# EAGLE design DEGREE_V3 (EAGLE 9.1.2)
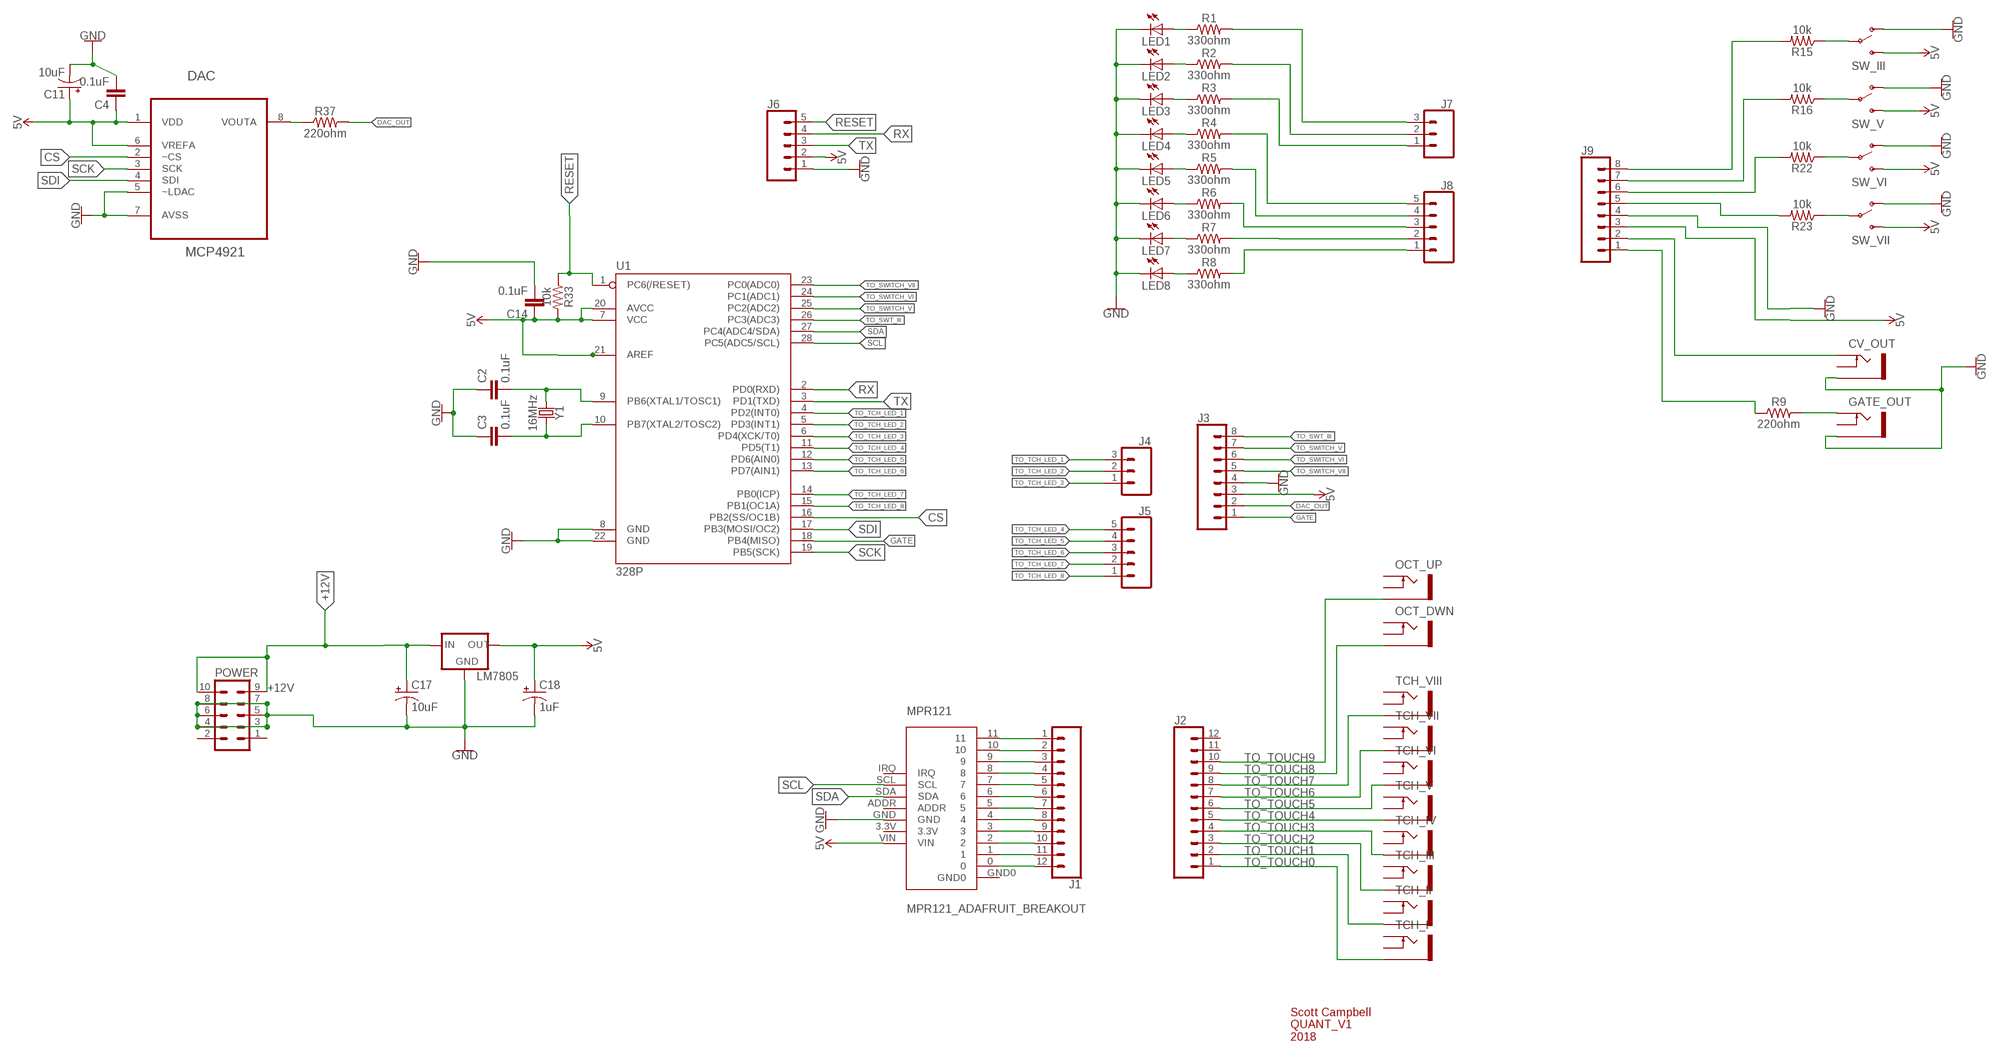
[diagram p0: schematic, sheet 1]

## Parts
C2  0.1uF  0.1UF-KIT-EZ-50V-20%  [CAP-PTH-SMALL-KIT]
C3  0.1uF  0.1UF-KIT-EZ-50V-20%  [CAP-PTH-SMALL-KIT]
C4  0.1uF  0.1UF-KIT-EZ-50V-20%  [CAP-PTH-SMALL-KIT]
C11  10uF  10UF-POLAR-RADIAL-2.5MM-25V-20%  [CPOL-RADIAL-2.5MM-5MM]
C14  0.1uF  0.1UF-KIT-EZ-50V-20%  [CAP-PTH-SMALL-KIT]
C17  10uF  10UF-POLAR-RADIAL-2.5MM-25V-20%  [CPOL-RADIAL-2.5MM-5MM]
C18  1uF  10UF-POLAR-RADIAL-2.5MM-25V-20%  [CPOL-RADIAL-2.5MM-5MM]
CV_OUT  CV_OUT  THONKICONNNEW  [WQP-PJ301M-12_JACK]
DAC  MCP4921  [DIP08]
GATE_OUT  GATE_OUT  THONKICONNNEW  [WQP-PJ301M-12_JACK]
J1  CONN_12  [1X12]
J2  CONN_12  [1X12]
J3  CONN_08"  [1X08]
J4  CONN_03  [1X03]
J5  CONN_05  [1X05]
J6  CONN_05  [1X05]
J7  CONN_03  [1X03]
J8  CONN_05  [1X05]
J9  CONN_08"  [1X08]
LED1  LED3MM  [LED3MM]
LED2  LED3MM  [LED3MM]
LED3  LED3MM  [LED3MM]
LED4  LED3MM  [LED3MM]
LED5  LED3MM  [LED3MM]
LED6  LED3MM  [LED3MM]
LED7  LED3MM  [LED3MM]
LED8  LED3MM  [LED3MM]
LM7805  V_REG_78XXTO-92_UNTESTED  [TO-92]
MPR121  MPR121_ADAFRUIT_BREAKOUT  [MPR121_ADAFRUIT_BREAKOUT]
OCT_DWN  THONKICONN-ESSY  [THONKICONN-ESSY]
OCT_UP  THONKICONN-ESSY  [THONKICONN-ESSY]
POWER  EURO_POWER_HEADERREGULAR  [EURO_POWER_HEADER]
R1  330ohm  1KOHM-HORIZ-1/4W-5%  [AXIAL-0.3]
R2  330ohm  1KOHM-HORIZ-1/4W-5%  [AXIAL-0.3]
R3  330ohm  1KOHM-HORIZ-1/4W-5%  [AXIAL-0.3]
R4  330ohm  1KOHM-HORIZ-1/4W-5%  [AXIAL-0.3]
R5  330ohm  1KOHM-HORIZ-1/4W-5%  [AXIAL-0.3]
R6  330ohm  1KOHM-HORIZ-1/4W-5%  [AXIAL-0.3]
R7  330ohm  1KOHM-HORIZ-1/4W-5%  [AXIAL-0.3]
R8  330ohm  1KOHM-HORIZ-1/4W-5%  [AXIAL-0.3]
R9  220ohm  RESISTOR_HORZ  [HORIZONTAL_RESISTOR]
R15  10k  RESISTOR_HORZ  [HORIZONTAL_RESISTOR]
R16  10k  RESISTOR_HORZ  [HORIZONTAL_RESISTOR]
R22  10k  RESISTOR_HORZ  [HORIZONTAL_RESISTOR]
R23  10k  RESISTOR_HORZ  [HORIZONTAL_RESISTOR]
R33  10k  RESISTOR_HORZ  [HORIZONTAL_RESISTOR]
R37  220ohm  RESISTOR_VERT  [VERTICAL_RESISTOR]
SW_III  SUBMINI_SPDT  [SUBMINI_TOGGLE]
SW_V  SUBMINI_SPDT  [SUBMINI_TOGGLE]
SW_VI  SUBMINI_SPDT  [SUBMINI_TOGGLE]
SW_VII  SUBMINI_SPDT  [SUBMINI_TOGGLE]
TCH_I  THONKICONN-ESSY  [THONKICONN-ESSY]
TCH_II  THONKICONN-ESSY  [THONKICONN-ESSY]
TCH_III  THONKICONN-ESSY  [THONKICONN-ESSY]
TCH_IV  THONKICONN-ESSY  [THONKICONN-ESSY]
TCH_V  THONKICONN-ESSY  [THONKICONN-ESSY]
TCH_VI  THONKICONN-ESSY  [THONKICONN-ESSY]
TCH_VII  THONKICONN-ESSY  [THONKICONN-ESSY]
TCH_VIII  THONKICONN-ESSY  [THONKICONN-ESSY]
U1  328P  ATMEGA328P_PDIP  [DIP28]
Y1  16MHz  CRYSTAL-16MHZPTH-HC49US  [HC49US]

## Nets
5V: C4.1 C11.1(+) C14.1 C18.1(+) DAC.1(VDD) DAC.6(VREFA) J3.3 J6.2 J9.3 LM7805.1(OUT) MPR121.VIN R33.2 SW_III.3(S) SW_V.3(S) SW_VI.3(S) SW_VII.3(S) U1.7(VCC) U1.20(AVCC) U1.21(AREF)
+12V: C17.1(+) LM7805.3(IN) POWER.9 POWER.10
CS: DAC.2(~CS) U1.16(PB2(SS/OC1B))
DAC_OUT: J3.2 R37.2
GATE: J3.1 U1.18(PB4(MISO))
GND: C2.1 C3.1 C4.2 C11.2(-) C14.2 C17.2(-) C18.2(-) CV_OUT.P$3_SLEEVE(SLEEVE) DAC.5(~LDAC) DAC.7(AVSS) GATE_OUT.P$3_SLEEVE(SLEEVE) J3.4 J6.1 J9.4 LED1.K(C) LED2.K(C) LED3.K(C) LED4.K(C) LED5.K(C) LED6.K(C) LED7.K(C) LED8.K(C) LM7805.2(GND) MPR121.GND POWER.3 POWER.4 POWER.5 POWER.6 POWER.7 POWER.8 SW_III.1(O) SW_V.1(O) SW_VI.1(O) SW_VII.1(O) U1.8(GND) U1.22(GND)
N$1: DAC.8(VOUTA) R37.1
N$2: GATE_OUT.P$1_TIP(TIP) R9.2
N$3: J9.5 R23.2
N$4: R23.1 SW_VII.COM(COMMON)
N$5: R22.1 SW_VI.COM(COMMON)
N$6: R16.1 SW_V.COM(COMMON)
N$7: R15.1 SW_III.COM(COMMON)
N$8: J9.6 R22.2
N$9: C3.2 U1.10(PB7(XTAL2/TOSC2)) Y1.2
N$10: J9.7 R16.2
N$11: C2.2 U1.9(PB6(XTAL1/TOSC1)) Y1.1
N$12: J9.8 R15.2
N$14: J9.1 R9.1
N$15: CV_OUT.P$1_TIP(TIP) J9.2
N$21: J1.1 MPR121.11
N$25: J1.2 MPR121.10
N$31: J1.3 MPR121.9
N$34: J1.4 MPR121.8
N$37: J1.5 MPR121.7
N$38: J1.6 MPR121.6
N$39: J1.7 MPR121.5
N$42: LED1.A R1.P$1
N$43: LED2.A R2.P$1
N$44: J1.8 MPR121.4
N$45: J1.9 MPR121.3
N$46: J1.10 MPR121.2
N$47: J1.11 MPR121.1
N$48: J1.12 MPR121.0
N$50: LED3.A R3.P$1
N$51: LED4.A R4.P$1
N$52: LED5.A R5.P$1
N$53: LED6.A R6.P$1
N$54: LED7.A R7.P$1
N$55: LED8.A R8.P$1
RESET: J6.5 R33.1 U1.1(PC6(/RESET))
RX: J6.4 U1.2(PD0(RXD))
SCK: DAC.3(SCK) U1.19(PB5(SCK))
SCL: MPR121.SCL U1.28(PC5(ADC5/SCL))
SDA: MPR121.SDA U1.27(PC4(ADC4/SDA))
SDI: DAC.4(SDI) U1.17(PB3(MOSI/OC2))
TCH_LED_1: J7.3 R1.P$2
TCH_LED_2: J7.2 R2.P$2
TCH_LED_3: J7.1 R3.P$2
TCH_LED_4: J8.5 R4.P$2
TCH_LED_5: J8.4 R5.P$2
TCH_LED_6: J8.3 R6.P$2
TCH_LED_7: J8.2 R7.P$2
TCH_LED_8: J8.1 R8.P$2
TO_SWITCH_V: J3.7 U1.25(PC2(ADC2))
TO_SWITCH_VI: J3.6 U1.24(PC1(ADC1))
TO_SWITCH_VII: J3.5 U1.23(PC0(ADC0))
TO_SWT_III: J3.8 U1.26(PC3(ADC3))
TO_TCH_LED_1: J4.3 U1.4(PD2(INT0))
TO_TCH_LED_2: J4.2 U1.5(PD3(INT1))
TO_TCH_LED_3: J4.1 U1.6(PD4(XCK/T0))
TO_TCH_LED_4: J5.5 U1.11(PD5(T1))
TO_TCH_LED_5: J5.4 U1.12(PD6(AIN0))
TO_TCH_LED_6: J5.3 U1.13(PD7(AIN1))
TO_TCH_LED_7: J5.2 U1.14(PB0(ICP))
TO_TCH_LED_8: J5.1 U1.15(PB1(OC1A))
TO_TOUCH0: J2.1 TCH_I.P$3_SLEEVE(SLEEVE)
TO_TOUCH1: J2.2 TCH_II.P$3_SLEEVE(SLEEVE)
TO_TOUCH2: J2.3 TCH_III.P$3_SLEEVE(SLEEVE)
TO_TOUCH3: J2.4 TCH_IV.P$3_SLEEVE(SLEEVE)
TO_TOUCH4: J2.5 TCH_V.P$3_SLEEVE(SLEEVE)
TO_TOUCH5: J2.6 TCH_VI.P$3_SLEEVE(SLEEVE)
TO_TOUCH6: J2.7 TCH_VII.P$3_SLEEVE(SLEEVE)
TO_TOUCH7: J2.8 TCH_VIII.P$3_SLEEVE(SLEEVE)
TO_TOUCH8: J2.9 OCT_DWN.P$3_SLEEVE(SLEEVE)
TO_TOUCH9: J2.10 OCT_UP.P$3_SLEEVE(SLEEVE)
TX: J6.3 U1.3(PD1(TXD))
Unconnected: CV_OUT.P$2_SWITCH(SWITCH) GATE_OUT.P$2_SWITCH(SWITCH) J2.11 J2.12 MPR121.3.3V MPR121.ADDR MPR121.GND0 MPR121.IRQ OCT_DWN.P$1_TIP(TIP) OCT_DWN.P$2_SWITCH(SWITCH) OCT_UP.P$1_TIP(TIP) OCT_UP.P$2_SWITCH(SWITCH) POWER.1 POWER.2 TCH_I.P$1_TIP(TIP) TCH_I.P$2_SWITCH(SWITCH) TCH_II.P$1_TIP(TIP) TCH_II.P$2_SWITCH(SWITCH) TCH_III.P$1_TIP(TIP) TCH_III.P$2_SWITCH(SWITCH) TCH_IV.P$1_TIP(TIP) TCH_IV.P$2_SWITCH(SWITCH) TCH_V.P$1_TIP(TIP) TCH_V.P$2_SWITCH(SWITCH) TCH_VI.P$1_TIP(TIP) TCH_VI.P$2_SWITCH(SWITCH) TCH_VII.P$1_TIP(TIP) TCH_VII.P$2_SWITCH(SWITCH) TCH_VIII.P$1_TIP(TIP) TCH_VIII.P$2_SWITCH(SWITCH)

## Notes on the sheet
- Scott Campbell
  QUANT_V1
  2018

## Library data of the parts
C2-C4 C14 = SparkFun-Capacitors:0.1UF: 0.1µF ceramic capacitors A capacitor is a passive two-terminal electrical component used to store electrical energy temporarily in an electric field.; PROD_ID: CAP-08370
C11 C17 = SparkFun-Capacitors:10UF-POLAR: 10.0µF polarized capacitors A capacitor is a passive two-terminal electrical component used to store electrical energy temporarily in an electric field.; PROD_ID: CAP-08440
C18 = SparkFun-Capacitors:10UF-POLAR: 10.0µF polarized capacitors A capacitor is a passive two-terminal electrical component used to store electrical energy temporarily in an electric field.; PROD_ID: CAP-08440; VALUE: 10uF
CV_OUT GATE_OUT = MusicThingModular:THONKICONN: 3.5mm socket for Eurorack modular synths
DAC = ESSY:MCP4921
J1 J2 = SparkFun-Connectors:CONN_12: Multi connection point. Often used as Generic Header-pin footprint for 0.1 inch spaced/style header connections On any of the 0.1 inch spaced packages, you can populate with these: Break Away Headers - Straight <https://www.sparkfun.com/products/116> (PRT-00116) Break Away Male Headers - Right Angle <https://www.sparkfun.com/products/553> (PRT-00553) Female Headers <https://www.sparkfun.com/products/115> (PRT-00115) Break Away Headers - Machine Pin <https://www.sparkfun.com/products/117> (PRT-00117) Break Away Female Headers - Swiss Machine Pin <https://www.sparkfun.com/products/743> (PRT-00743) For SCREWTERMINALS and SPRING TERMINALS visit here: Screw Terimnals on SparkFun.com <https://www.sparkfun.com/search/results?term=Screw+Terminals> (5mm/3.5mm/2.54mm spacing) This device is also useful as a general connection point to wire up your design to another part of your project. Our various solder wires solder well into these plated through hole pads. Hook-Up Wire - Assortment (Stranded, 22 AWG) <https://www.sparkfun.com/products/11375> (PRT-11375) Hook-Up Wire - Assortment (Solid Core, 22 AWG) <https://www.sparkfun.com/products/11367> (PRT-11367) View the entire wire category on our website here <https://www.sparkfun.com/categories/141> Special notes: Molex polarized connector foot print use with SKU : PRT-08231 with associated crimp pins and housings. 1MM SMD Version SKU: PRT-10208 NOTES ON THE VARIANTS LOCK and LOCK_LONGPADS... This footprint was designed to help hold the alignment of a through-hole component (i.e. 6-pin header) while soldering it into place. You may notice that each hole has been shifted either up or down by 0.005 of an inch from it's more standard position (which is a perfectly straight line). This slight alteration caused the pins (the squares in the middle) to touch the edges of the holes. Because they are alternating, it causes a "brace" to hold the component in place. 0.005 has proven to be the perfect amount of "off-center" position when using our standard breakaway headers. Although looks a little odd when you look at the bare footprint, once you have a header in there, the alteration is very hard to notice. Also,if you push a header all the way into place, it is covered up entirely on the bottom side.
J3 J9 = SparkFun-Connectors:CONN_08: Multi connection point. Often used as Generic Header-pin footprint for 0.1 inch spaced/style header connections On any of the 0.1 inch spaced packages, you can populate with these: Break Away Headers - Straight <https://www.sparkfun.com/products/116> (PRT-00116) Break Away Male Headers - Right Angle <https://www.sparkfun.com/products/553> (PRT-00553) Female Headers <https://www.sparkfun.com/products/115> (PRT-00115) Break Away Headers - Machine Pin <https://www.sparkfun.com/products/117> (PRT-00117) Break Away Female Headers - Swiss Machine Pin <https://www.sparkfun.com/products/743> (PRT-00743) Arduino Stackable Header - 8 Pin <https://www.sparkfun.com/products/9279> (PRT-09279) For SCREWTERMINALS and SPRING TERMINALS visit here: Screw Terimnals on SparkFun.com <https://www.sparkfun.com/search/results?term=Screw+Terminals> (5mm/3.5mm/2.54mm spacing) This device is also useful as a general connection point to wire up your design to another part of your project. Our various solder wires solder well into these plated through hole pads. Hook-Up Wire - Assortment (Stranded, 22 AWG) <https://www.sparkfun.com/products/11375> (PRT-11375) Hook-Up Wire - Assortment (Solid Core, 22 AWG) <https://www.sparkfun.com/products/11367> (PRT-11367) View the entire wire category on our website here <https://www.sparkfun.com/categories/141> Special notes: Molex polarized connector foot print use with SKU : PRT-08231 with associated crimp pins and housings. 1MM SMD Version SKU: PRT-10208 NOTES ON THE VARIANTS LOCK and LOCK_LONGPADS... This footprint was designed to help hold the alignment of a through-hole component (i.e. 6-pin header) while soldering it into place. You may notice that each hole has been shifted either up or down by 0.005 of an inch from it's more standard position (which is a perfectly straight line). This slight alteration caused the pins (the squares in the middle) to touch the edges of the holes. Because they are alternating, it causes a "brace" to hold the component in place. 0.005 has proven to be the perfect amount of "off-center" position when using our standard breakaway headers. Although looks a little odd when you look at the bare footprint, once you have a header in there, the alteration is very hard to notice. Also,if you push a header all the way into place, it is covered up entirely on the bottom side.; PROD_ID: CONN-08438
J4 J7 = SparkFun-Connectors:CONN_03: Multi connection point. Often used as Generic Header-pin footprint for 0.1 inch spaced/style header connections On any of the 0.1 inch spaced packages, you can populate with these: Break Away Headers - Straight <https://www.sparkfun.com/products/116> (PRT-00116) Break Away Male Headers - Right Angle <https://www.sparkfun.com/products/553> (PRT-00553) Female Headers <https://www.sparkfun.com/products/115> (PRT-00115) Break Away Headers - Machine Pin <https://www.sparkfun.com/products/117> (PRT-00117) Break Away Female Headers - Swiss Machine Pin <https://www.sparkfun.com/products/743> (PRT-00743) Stackable Header - 3 Pin (Female, 0.1") <https://www.sparkfun.com/products/13875> (PRT-13875) For SCREWTERMINALS and SPRING TERMINALS visit here: Screw Terimnals on SparkFun.com <https://www.sparkfun.com/search/results?term=Screw+Terminals> (5mm/3.5mm/2.54mm spacing) This device is also useful as a general connection point to wire up your design to another part of your project. Our various solder wires solder well into these plated through hole pads. Hook-Up Wire - Assortment (Stranded, 22 AWG) <https://www.sparkfun.com/products/11375> (PRT-11375) Hook-Up Wire - Assortment (Solid Core, 22 AWG) <https://www.sparkfun.com/products/11367> (PRT-11367) View the entire wire category on our website here <https://www.sparkfun.com/categories/141> Special notes: Molex polarized connector foot print use with SKU : PRT-08232 with associated crimp pins and housings.; PROD_ID: XXX-00000; VALUE: 455-1750-1-ND
J5 J6 J8 = SparkFun-Connectors:CONN_05: Multi connection point. Often used as Generic Header-pin footprint for 0.1 inch spaced/style header connections On any of the 0.1 inch spaced packages, you can populate with these: Break Away Headers - Straight <https://www.sparkfun.com/products/116> (PRT-00116) Break Away Male Headers - Right Angle <https://www.sparkfun.com/products/553> (PRT-00553) Female Headers <https://www.sparkfun.com/products/115> (PRT-00115) Break Away Headers - Machine Pin <https://www.sparkfun.com/products/117> (PRT-00117) Break Away Female Headers - Swiss Machine Pin <https://www.sparkfun.com/products/743> (PRT-00743) For SCREWTERMINALS and SPRING TERMINALS visit here: Screw Terimnals on SparkFun.com <https://www.sparkfun.com/search/results?term=Screw+Terminals> (5mm/3.5mm/2.54mm spacing) This device is also useful as a general connection point to wire up your design to another part of your project. Our various solder wires solder well into these plated through hole pads. Hook-Up Wire - Assortment (Stranded, 22 AWG) <https://www.sparkfun.com/products/11375> (PRT-11375) Hook-Up Wire - Assortment (Solid Core, 22 AWG) <https://www.sparkfun.com/products/11367> (PRT-11367) View the entire wire category on our website here <https://www.sparkfun.com/categories/141> Special notes: Molex polarized connector foot print use with SKU : PRT-08231 with associated crimp pins and housings. 1MM SMD Version SKU: PRT-10208
LED1-LED8 = adafruit:LED: LED OSRAM: - CHIPLED LG R971, LG N971, LY N971, LG Q971, LY Q971, LO R971, LY R971 LH N974, LH R974 LS Q976, LO Q976, LY Q976 LO Q996 - Hyper CHIPLED LW Q18S LB Q993, LB Q99A, LB R99A - SideLED LS A670, LO A670, LY A670, LG A670, LP A670 LB A673, LV A673, LT A673, LW A673 LH A674 LY A675 LS A676, LA A676, LO A676, LY A676, LW A676 LS A679, LY A679, LG A679 - Hyper Micro SIDELED® LS Y876, LA Y876, LO Y876, LY Y876 LT Y87S - SmartLED LW L88C, LW L88S LB L89C, LB L89S, LG L890 LS L89K, LO L89K, LY L89K LS L896, LA L896, LO L896, LY L896 - TOPLED LS T670, LO T670, LY T670, LG T670, LP T670 LSG T670, LSP T670, LSY T670, LOP T670, LYG T670 LG T671, LOG T671, LSG T671 LB T673, LV T673, LT T673, LW T673 LH T674 LS T676, LA T676, LO T676, LY T676, LB T676, LH T676, LSB T676, LW T676 LB T67C, LV T67C, LT T67C, LS T67K, LO T67K, LY T67K, LW E67C LS E67B, LA E67B, LO E67B, LY E67B, LB E67C, LV E67C, LT E67C LW T67C LS T679, LY T679, LG T679 LS T770, LO T770, LY T770, LG T770, LP T770 LB T773, LV T773, LT T773, LW T773 LH T774 LS E675, LA E675, LY E675, LS T675 LS T776, LA T776, LO T776, LY T776, LB T776 LHGB T686 LT T68C, LB T68C - Hyper Mini TOPLED® LB M676 - Mini TOPLED Santana® LG M470 LS M47K, LO M47K, LY M47K Source: http://www.osram.convergy.de/
LM7805 = SparkFun-IC-Power:V_REG_78XX: Voltage Regulator Standard 78xx regulator. IGO (Input Ground Output). Spark Fun Electronics SKU : COM-00107
MPR121 = ESSY:MPR121_ADAFRUIT_BREAKOUT
OCT_DWN OCT_UP TCH_I TCH_II TCH_III TCH_IV TCH_V TCH_VI TCH_VII TCH_VIII = ESSY:THONKICONN-ESSY
POWER = MusicThingModular:EURO_POWER_HEADER: Power Header 10 pin power header for Eurorack Power Supplies Variants with fatter pads for easier soldering, and the LOCK variant which has 5mil offset pins to hold the component in place before soldering
R1-R8 = SparkFun-Resistors:1KOHM: 1kΩ resistor A resistor is a passive two-terminal electrical component that implements electrical resistance as a circuit element. Resistors act to reduce current flow, and, at the same time, act to lower voltage levels within circuits. - Wikipedia; PROD_ID: RES-08380; VALUE: 1k
R9 R15 R16 R22 R23 R33 = ESSY:RESISTOR_HORZ
R37 = ESSY:RESISTOR_VERT
SW_III SW_V SW_VI SW_VII = MusicThingModular:SUBMINI_SPDT
U1 = SparkFun-IC-Microcontroller:ATMEGA328P_PDIP: Atmel 328P Through hole ATMEGA328P uC used in the Arduino 32kb flash, 1k EEPROM, 2k SRAM Datasheet <http://www.sparkfun.com/datasheets/Components/SMD/ATMega328.pdf> SparkFun Products Storefront component: AVR 28 Pin 20MHz 32K 6A/D - ATMega328P <https://www.sparkfun.com/products/9061> (COM-09061) SparkFun Simon Says - Through-Hole Soldering Kit <https://www.sparkfun.com/products/10547> (KIT-10547) SparkFun Learn to Solder - Simon Says <https://www.sparkfun.com/products/13708> (KIT-13708) SparkFun BigTime Watch Kit <https://www.sparkfun.com/products/11734> (KIT-11734) SparkFun ClockIt <https://www.sparkfun.com/products/10930> (KIT-10930) SparkFun Serial Enabled LCD Kit <https://www.sparkfun.com/products/10097> (LCD-10097) SparkFun Simon Tilts - Through Hole Soldering Kit <https://www.sparkfun.com/products/12634> (KIT-12634) SparkFun Frequency Counter Kit <https://www.sparkfun.com/products/10140> (KIT-10140) FabFM Radio Kit <https://www.sparkfun.com/products/11043> (KIT-11043) SparkFun Binary Blaster Kit <https://www.sparkfun.com/products/12037> (KIT-12037) SparkFun Metro-Gnome <https://www.sparkfun.com/products/9236> (KIT-09236) ATmega328 with Arduino Optiboot (Uno) <https://www.sparkfun.com/products/10524> (DEV-10524); PROD_ID: IC-09136
Y1 = SparkFun-Clocks:CRYSTAL-16MHZ: 16MHz Crystal Digikey Example <http://www.digikey.com/product-search/en?keywords=535-9122-1-ND> Frequency: 16MHz Frequency Stability: ±50ppm Frequency Tolerance: ±20ppm Load Capacitance: 18pF SparkFun Products: Pro Micro -5V/16MHz <https://www.sparkfun.com/products/12640> SparkFun Serial Enabled LCD Kit <https://www.sparkfun.com/products/10097>; PROD_ID: XTAL-08181; SF_ID: COM-00536

## Board
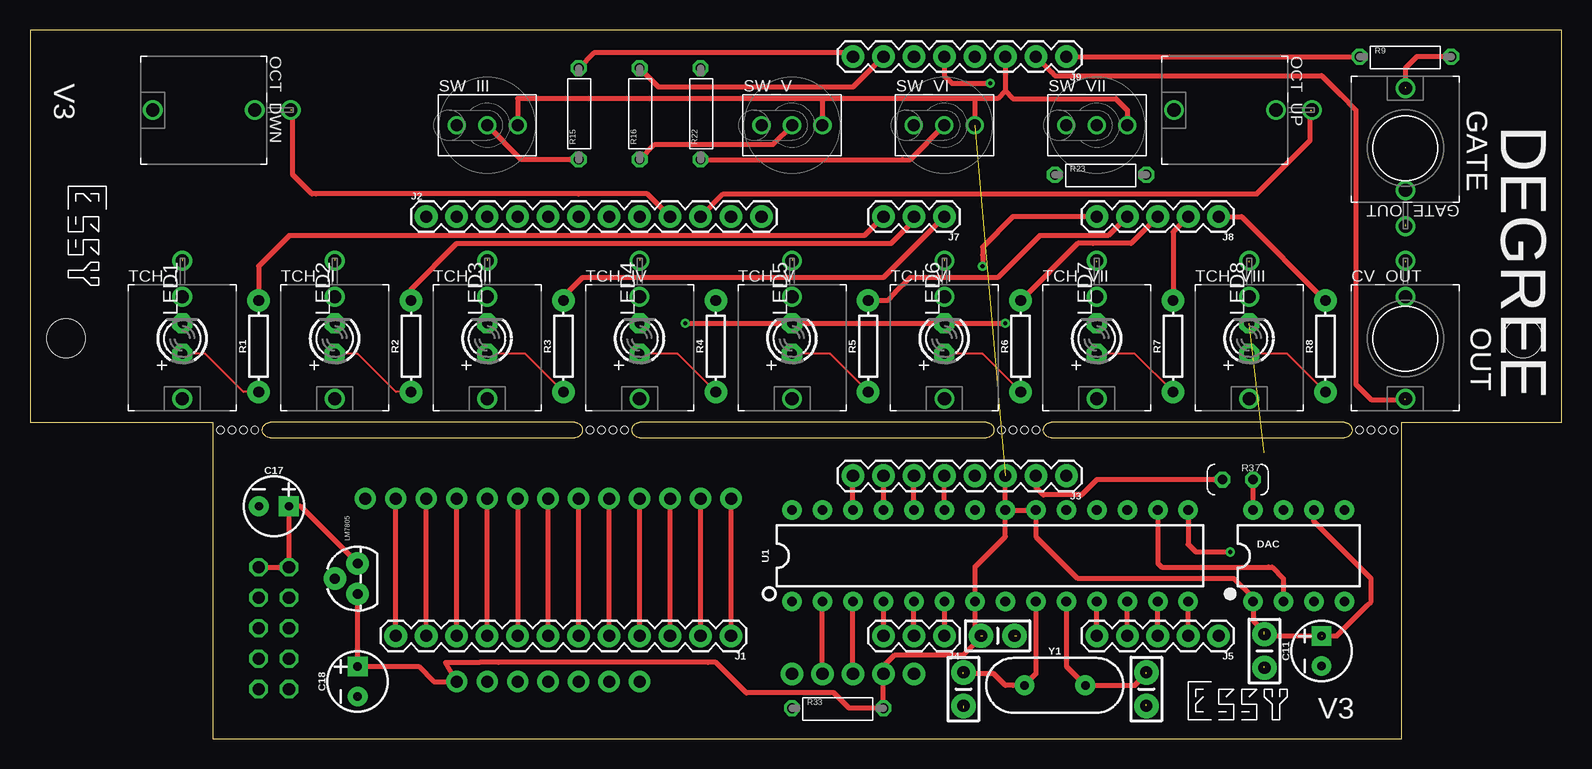
[diagram p1: board, top side]
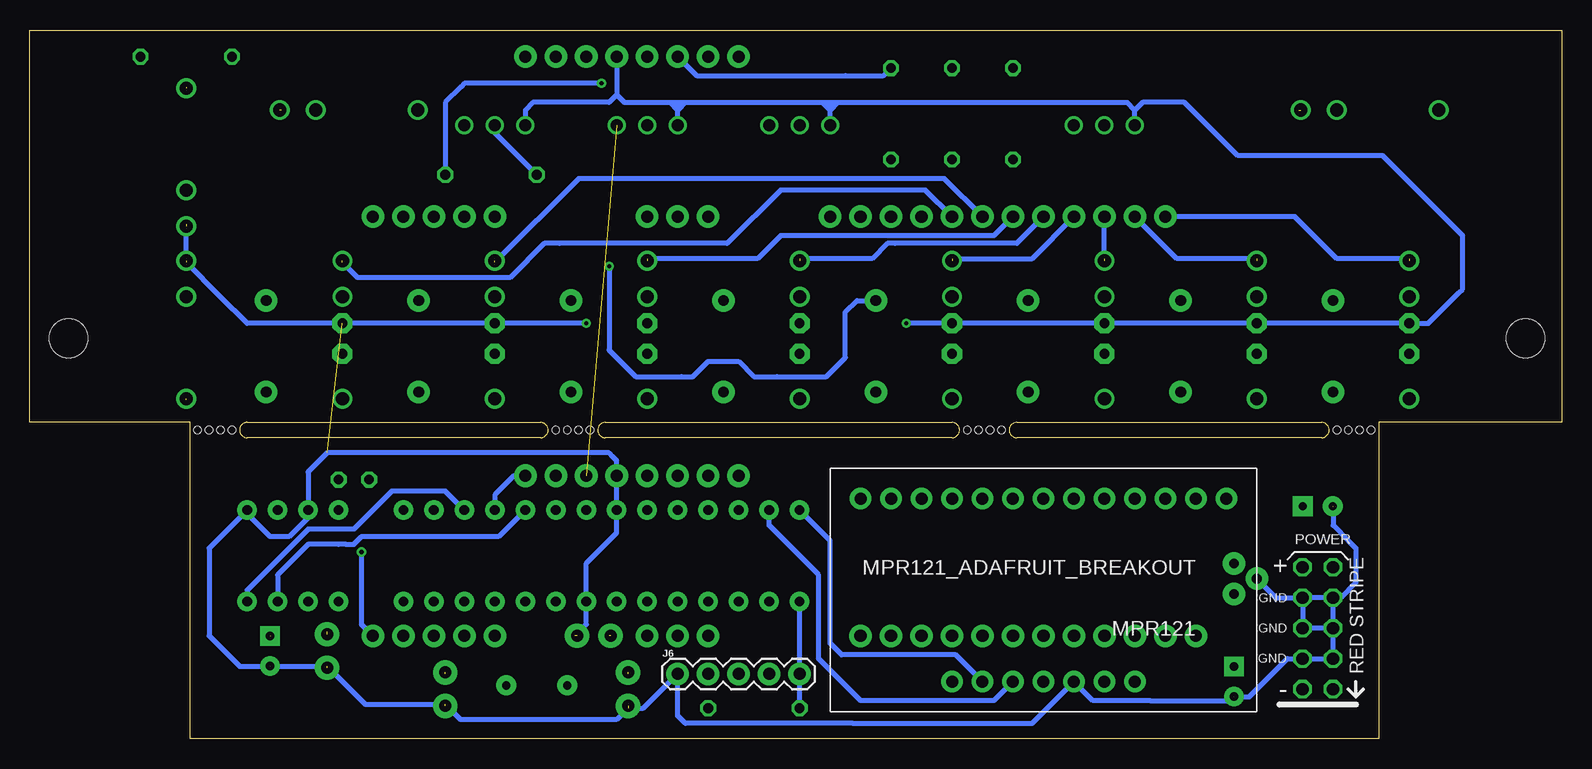
[diagram p2: board, bottom side, seen from below]

Size 127.64 x 59.05 mm. Coordinates in mm from the lower left corner, seen from the top.
Outline: 15.24,0 114.3,0 114.3,26.35 127.64,26.35 127.64,59.05 0,59.05 0,26.35 15.24,26.35 15.24,0
Outline: 20,25.08 45.4,25.08 arc180 45.4,26.35 20,26.35 arc180 20,25.08
Outline: 85.09,25.08 109.54,25.08 arc180 109.54,26.35 85.09,26.35 arc180 85.09,25.08
Outline: 50.8,25.08 79.69,25.08 arc180 79.69,26.35 50.8,26.35 arc180 50.8,25.08
Copper layers (1*16): Top 0.035mm / dielectric 1.5mm / Bottom 0.035mm
Design rules "default": minimum track width 6mil, minimum drill 0.35mm, track to track 6mil, track to pad 6mil, pad to pad 6mil, via to via 6mil, smd to smd 6mil, copper to edge 40mil, drill to drill 6mil, minimum pad ring 10mil, minimum via ring 8mil, stop-mask expansion 4mil, vias tented up to drill 0mil, thermal gap 10mil
Holes 0.6 mm at 110.81,25.72 111.76,25.72 112.71,25.72 113.67,25.72 80.96,25.72 81.92,25.72 82.87,25.72 83.82,25.72 15.88,25.72 16.83,25.72 17.78,25.72 18.73,25.72 46.67,25.72 47.62,25.72 48.58,25.72 49.53,25.72

### Footprints (pad centres in the part's own frame; a part is rotated, then mirrored left to right if it is on the bottom)
CAP-PTH-SMALL-KIT = drill 1.016 pad 2.032: 1 -1.397,0; 2 1.397,0
CPOL-RADIAL-2.5MM-5MM = drill 0.7 pad 1.651 square: 1 1.25,0 | drill 0.7 pad 1.651: 2 -1.25,0
WQP-PJ301M-12_JACK = drill 1.1: P$1_TIP 0,5; P$2_SWITCH 0,-3.5; P$3_SLEEVE 0,-6.5
DIP08 = drill 0.813 pad 1.626: 1 -3.81,-3.81; 2 -1.27,-3.81; 3 1.27,-3.81; 4 3.81,-3.81; 5 3.81,3.81; 6 1.27,3.81; 7 -1.27,3.81; 8 -3.81,3.81
1X12 = drill 1.016 pad 1.88: 1 0,0; 2 2.54,0; 3 5.08,0; 4 7.62,0; 5 10.16,0; 6 12.7,0; 7 15.24,0; 8 17.78,0; 9 20.32,0; 10 22.86,0; 11 25.4,0; 12 27.94,0
1X08 = drill 1.016 pad 1.88: 1 0,0; 2 2.54,0; 3 5.08,0; 4 7.62,0; 5 10.16,0; 6 12.7,0; 7 15.24,0; 8 17.78,0
1X03 = drill 1.016 pad 1.88: 1 0,0; 2 2.54,0; 3 5.08,0
1X05 = drill 1.016 pad 1.88: 1 0,0; 2 2.54,0; 3 5.08,0; 4 7.62,0; 5 10.16,0
LED3MM = drill 0.813 pad 1.676 octagon: A -1.27,0; K 1.27,0
TO-92 = drill 0.813 pad 1.88: 1 -1.27,0; 2 0,1.905; 3 1.27,0
MPR121_ADAFRUIT_BREAKOUT = drill 1 pad 1.778: 0 17.78,-30.48; 1 17.78,-27.94; 2 17.78,-25.4; 3 17.78,-22.86; 3.3V 2.54,-22.86; 4 17.78,-20.32; 5 17.78,-17.78; 6 17.78,-15.24; 7 17.78,-12.7; 8 17.78,-10.16; 9 17.78,-7.62; 10 17.78,-5.08; 11 17.78,-2.54; ADDR 2.54,-17.78; GND 2.54,-20.32; GND0 17.78,-33.02; IRQ 2.54,-10.16; SCL 2.54,-12.7; SDA 2.54,-15.24; VIN 2.54,-25.4
THONKICONN-ESSY = drill 1.1: P$1_TIP 0,5; P$2_SWITCH 0,-3.5; P$3_SLEEVE 0,-6.5
EURO_POWER_HEADER = drill 1.016 octagon: 1 -5.08,-1.27; 2 -5.08,1.27; 3 -2.54,-1.27; 4 -2.54,1.27; 5 0,-1.27; 6 0,1.27; 7 2.54,-1.27; 8 2.54,1.27; 9 5.08,-1.27; 10 5.08,1.27
AXIAL-0.3 = drill 0.9 pad 1.88: P$1 -3.81,0; P$2 3.81,0
HORIZONTAL_RESISTOR = drill 0.813 octagon: 1 -3.81,0; 2 3.81,0
VERTICAL_RESISTOR = drill 0.813 octagon: 1 -1.27,0; 2 1.27,0
SUBMINI_TOGGLE = drill 1 pad 1.422: 1 -2.54,0; 3 2.54,0; COM 0,0
DIP28 = drill 0.813 pad 1.626: 1 -16.51,-3.81; 2 -13.97,-3.81; 3 -11.43,-3.81; 4 -8.89,-3.81; 5 -6.35,-3.81; 6 -3.81,-3.81; 7 -1.27,-3.81; 8 1.27,-3.81; 9 3.81,-3.81; 10 6.35,-3.81; 11 8.89,-3.81; 12 11.43,-3.81; 13 13.97,-3.81; 14 16.51,-3.81; 15 16.51,3.81; 16 13.97,3.81; 17 11.43,3.81; 18 8.89,3.81; 19 6.35,3.81; 20 3.81,3.81; 21 1.27,3.81; 22 -1.27,3.81; 23 -3.81,3.81; 24 -6.35,3.81; 25 -8.89,3.81; 26 -11.43,3.81; 27 -13.97,3.81; 28 -16.51,3.81
EURO_PANEL_SCREW_HOLE = hole 3.2: -0.032,0.032
HC49US = drill 0.7 pad 1.651: 1 -2.54,0; 2 2.54,0

### Placement (x,y rotation side)
C2  77.79,4.13 90 top
C3  93.03,4.13 90 top
C4  102.87,7.3 270 top
C11  107.63,7.3 90 top
C14  80.64,8.57 0 top
C17  20.32,19.37 0 top
C18  27.3,4.76 90 top
CV_OUT  114.62,33.34 180 top
DAC  105.73,15.24 0 top
GATE_OUT  114.62,49.21 0 top
J1  58.42,8.57 180 top
J2  33.02,43.5 0 top
J3  86.36,21.91 180 top
J4  76.2,8.57 180 top
J5  99.06,8.57 180 top
J6  73.66,5.4 0 bottom
J7  76.2,43.5 180 top
J8  99.06,43.5 180 top
J9  86.36,56.83 180 top
LED1  12.7,33.34 90 top
LED2  25.4,33.34 90 top
LED3  38.1,33.34 90 top
LED4  50.8,33.34 90 top
LED5  63.5,33.34 90 top
LED6  76.2,33.34 90 top
LED7  88.9,33.34 90 top
LED8  101.6,33.34 90 top
LM7805  27.3,13.34 90 top
MPR121  60.96,2.22 90 bottom
OCT_DWN  15.24,52.39 90 top
OCT_UP  100.33,52.39 90 top
POWER  20.32,9.21 90 bottom
R1  19.05,32.7 90 top
R2  31.75,32.7 90 top
R3  44.45,32.7 90 top
R4  57.15,32.7 90 top
R5  69.85,32.7 90 top
R6  82.55,32.7 90 top
R7  95.25,32.7 90 top
R8  107.95,32.7 90 top
R9  114.62,56.83 0 top
R15  45.72,52.07 90 top
R16  50.8,52.07 90 top
R22  55.88,52.07 90 top
R23  89.22,46.99 0 top
R33  67.31,2.54 0 top
R37  100.65,21.59 180 top
SW_III  38.1,51.12 0 top
SW_V  63.5,51.12 0 top
SW_VI  76.2,51.12 0 top
SW_VII  88.9,51.12 0 top
TCH_I  12.7,33.34 180 top
TCH_II  25.4,33.34 180 top
TCH_III  38.1,33.34 180 top
TCH_IV  50.8,33.34 180 top
TCH_V  63.5,33.34 180 top
TCH_VI  76.2,33.34 180 top
TCH_VII  88.9,33.34 180 top
TCH_VIII  101.6,33.34 180 top
U1  80.01,15.24 0 top
U$2  [LOGO_SM]  6.35,46.04 270 top
U$3  [EURO_PANEL_SCREW_HOLE]  3.04,33.34 0 top
U$4  [EURO_PANEL_SCREW_HOLE]  124.46,33.34 0 top
U$6  [LOGO_SM]  96.52,4.76 0 top
Y1  85.41,4.45 0 top

### Tracks (layer width: path | path; a pad name or v marks a point on that pad's centre or on a via)
5V  (4 unrouted)
  Top 0.406: U1.21 U1.20 83.82,16.83 85.41,15.24 87.31,13.34 90.17,13.34 100.33,13.34 101.92,11.75 DAC.1 101.92,9.84 102.87,8.89 103.19,8.57 107.63,8.57 108.9,8.57 111.44,11.11 111.76,11.43 111.76,11.75 111.76,13.34 110.17,14.92 107,18.1 DAC.6 | U1.21 81.28,16.83 78.74,14.29 78.74,13.97 U1.7 78.74,9.84 78.74,9.21 79.38,8.57 77.79,6.99 76.83,6.99 74.61,6.99 72.07,6.99 71.12,6.03 J6.2 R33.2 68.9,2.54 68.26,2.54 67.31,3.49 66.99,3.81 59.69,3.81 57.15,6.35 56.52,6.35 39.05,6.35 37.47,6.35 34.61,6.35 MPR121.VIN 33.66,4.76 32.38,6.03 27.3,6.03 | U1.21 J3.3 | C18.1 27.3,6.03 | 27.3,6.03 LM7805.1 | J9.3 81.28,53.98 | 81.28,53.98 80.64,53.34 78.74,53.34 | 78.74,53.34 66.04,53.34 | 66.04,53.34 40.64,53.34 SW_III.3 | 81.28,53.98 81.92,53.34 90.49,53.34 91.44,52.39 SW_VII.3 | 78.74,53.34 SW_VI.3 | 66.04,53.34 SW_V.3
+12V
  Top 0.406: LM7805.3 22.54,19.37 C17.1 21.59,19.35 POWER.10 POWER.9
CS
  Top 0.406: U1.16 93.98,14.61 94.3,14.29 103.19,14.29 103.5,14.29 104.46,13.34 DAC.2
DAC_OUT
  Top 0.406: R37.2 88.9,21.59 87.63,20.32 84.45,20.32 83.82,20.95 J3.2
GATE
  Bottom 0.406: J3.1 87.31,21.91 88.9,20.32 U1.18
GND  (via drill 0.35)  (10 unrouted)
  Top 0.406: v54.61,34.61 LED5.K LED6.K v81.28,34.61
  Bottom 0.406: DAC.7 104.46,19.37 | 82.23,8.57 81.28,9.53 U1.8 81.28,14.61 79.06,16.83 78.74,17.14 U1.22 J3.4 78.74,23.18 79.06,23.5 79.38,23.81 102.87,23.81 103.82,22.86 104.46,22.23 DAC.7 | DAC.7 104.46,18.41 106.05,16.83 107.63,16.83 109.54,18.73 DAC.5 112.71,15.88 112.71,8.57 110.49,6.35 110.17,6.03 107.63,6.03 102.87,6.03 99.69,2.86 93.03,2.86 91.76,1.59 91.12,1.59 78.74,1.59 77.79,2.54 76.52,2.54 J6.1 73.66,1.91 73.03,1.27 59.05,1.27 44.13,1.27 42.23,3.17 MPR121.GND 39.05,3.17 34.29,3.17 27.62,3.17 27.3,3.49 26.04,3.49 22.86,6.67 POWER.4 POWER.3 POWER.5 | 19.05,19.37 19.05,17.78 17.78,16.51 17.14,15.88 17.14,13.02 18.41,11.75 POWER.7 | POWER.7 POWER.8 | POWER.8 POWER.6 POWER.5 | POWER.5 POWER.7 | LM7805.2 23.81,11.75 POWER.8 | J9.4 78.74,53.66 | 78.74,53.66 78.11,53.02 74.93,53.02 74.3,53.02 | 73.66,51.75 SW_VI.1 73.66,52.39 | 74.3,53.02 73.66,53.02 | 73.66,53.02 73.03,53.02 | 73.03,53.02 61.59,53.02 | 61.59,53.02 60.96,53.02 | 60.96,53.02 60.33,53.02 | 60.33,53.02 36.2,53.02 35.56,52.39 | SW_III.1 35.56,52.39 | SW_V.1 60.96,52.39 | 60.96,52.39 60.96,53.02 | 73.66,52.39 73.66,53.02 | 78.74,53.66 79.38,53.02 85.72,53.02 86.36,52.39 SW_VII.1 | v54.61,34.61 LED4.K LED3.K LED2.K LED1.K 11.11,34.61 8.57,37.15 8.26,37.47 8.26,41.91 14.92,48.58 26.99,48.58 31.43,53.02 34.92,53.02 35.56,52.39 | v81.28,34.61 LED7.K LED8.K 109.54,34.61 111.76,36.83 114.62,39.69 114.62,40.01 114.62,42.86 | 60.33,53.02 60.96,52.39 | 60.96,52.39 61.59,53.02 | 73.03,53.02 73.66,52.39 | 73.66,52.39 74.3,53.02
N$1
  Top 0.406: DAC.8 R37.1
N$2  (1 unrouted)
  Top 0.406: R9.2 115.57,56.83 114.62,55.88 114.62,54.29
N$3  (via drill 0.35)
  Top 0.406: J9.5 76.2,55.24 76.83,54.61 v80.01,54.61
  Bottom 0.406: v80.01,54.61 91.44,54.61 91.76,54.29 93.03,53.02 R23.2
N$4
  Bottom 0.406: R23.1 88.9,50.48 SW_VII.COM
N$5
  Top 0.406: R22.1 72.71,48.26 73.34,48.26 SW_VI.COM
N$6
  Top 0.406: R16.1 52.07,49.53 61.59,49.53 61.91,49.53 SW_V.COM
N$7
  Top 0.406: R15.1 40.96,48.26 SW_III.COM
N$8
  Bottom 0.406: J9.6 72.07,55.24 59.69,55.24 56.52,55.24 R22.2
N$9  (1 unrouted)
  Top 0.406: U1.10 86.36,6.03 Y1.2 92.08,4.45 93.03,5.4
N$10
  Top 0.406: J9.7 68.58,54.29 53.02,54.29 52.39,54.29 R16.2
N$11  (1 unrouted)
  Top 0.406: U1.9 83.82,5.71 83.82,5.4 Y1.1 81.92,4.45 81.28,4.45 80.33,5.4 77.79,5.4
N$12
  Top 0.406: J9.8 68.26,57.15 46.99,57.15 R15.2
N$14
  Top 0.406: J9.1 R9.1
N$15  (1 unrouted)
  Top 0.406: J9.2 85.09,55.56 85.41,55.24 107.63,55.24 109.22,53.66 110.49,52.39 110.49,39.05 110.49,29.53 111.76,28.26 114.62,28.26
N$21
  Top 0.406: J1.1 MPR121.11
N$25
  Top 0.406: J1.2 MPR121.10
N$31
  Top 0.406: J1.3 MPR121.9
N$34
  Top 0.406: J1.4 MPR121.8
N$37
  Top 0.406: J1.5 MPR121.7
N$38
  Top 0.406: J1.6 MPR121.6
N$39
  Top 0.406: J1.7 MPR121.5
N$42
  Top 0.152: R1.P$1 17.78,28.89 14.61,32.07 LED1.A
N$43
  Top 0.152: R2.P$1 30.48,28.89 27.3,32.07 LED2.A
N$44
  Top 0.406: MPR121.4 J1.8
N$45
  Top 0.406: J1.9 MPR121.3
N$46
  Top 0.406: J1.10 MPR121.2
N$47
  Top 0.406: J1.11 MPR121.1
N$48
  Top 0.406: J1.12 MPR121.0
N$50
  Top 0.152: R3.P$1 41.27,32.07 LED3.A
N$51
  Top 0.152: R4.P$1 53.98,32.07 LED4.A
N$52
  Top 0.152: R5.P$1 66.67,32.07 LED5.A
N$53
  Top 0.152: R6.P$1 79.38,32.07 LED6.A
N$54
  Top 0.152: R7.P$1 92.08,32.07 LED7.A
N$55
  Top 0.152: R8.P$1 104.78,32.07 LED8.A
RESET
  Bottom 0.406: U1.1 J6.5 R33.1
RX
  Top 0.406: J6.4 U1.2
SCK
  Bottom 0.406: U1.19 88.58,16.83 100.01,16.83 100.65,16.19 101.28,16.19 101.92,16.19 104.46,16.19 107,13.65 DAC.3
SCL
  Bottom 0.406: MPR121.SCL 50.16,6.67 50.48,6.99 60.01,6.99 60.96,7.94 60.96,14.29 60.96,16.51 U1.28
SDA
  Bottom 0.406: MPR121.SDA 47.31,3.17 56.83,3.17 58.42,3.17 60.64,5.4 61.91,6.67 61.91,12.38 61.91,13.65 66.04,17.78 U1.27
SDI
  Bottom 0.406: U1.17 93.03,20.64 93.34,20.64 97.47,20.64 100.65,17.46 101.28,17.46 104.46,17.46 109.54,12.38 DAC.4
TCH_LED_1
  Top 0.406: J7.3 69.53,41.91 56.83,41.91 21.59,41.91 21.27,41.59 19.05,39.37 R1.P$2
TCH_LED_2
  Top 0.406: R2.P$2 31.75,37.47 35.56,41.27 71.75,41.27 72.07,41.59 73.66,43.18 J7.2
TCH_LED_3
  Top 0.406: J7.1 73.34,40.64 71.12,38.42 59.37,38.42 46.04,38.42 45.4,37.78 44.45,36.83 R3.P$2
TCH_LED_4  (via drill 0.35)
  Top 0.406: J8.5 83.82,43.5 81.92,43.5 79.38,40.96 79.38,40.32 v79.38,39.37
  Bottom 0.406: v79.38,39.37 79.38,32.38 77.15,30.16 73.34,30.16 72.39,30.16 71.12,31.43 68.58,31.43 67.31,30.16 65.41,30.16 61.28,30.16 59.69,31.75 59.69,35.56 58.74,36.51 R4.P$2
TCH_LED_5
  Top 0.406: J8.4 89.85,41.91 87.95,41.91 84.14,41.91 80.64,38.42 73.34,38.42 72.07,37.15 71.44,36.51 R5.P$2
TCH_LED_6
  Top 0.406: J8.3 91.76,41.27 88.58,41.27 87.31,41.27 R6.P$2
TCH_LED_7
  Top 0.406: J8.2 95.25,42.23 R7.P$2
TCH_LED_8
  Top 0.406: J8.1 100.97,43.5 R8.P$2
TO_SWITCH_V
  Top 0.406: J3.7 U1.25
TO_SWITCH_VI
  Top 0.406: U1.24 J3.6
TO_SWITCH_VII
  Top 0.406: U1.23 J3.5
TO_SWT_III
  Top 0.406: U1.26 J3.8
TO_TCH_LED_1
  Top 0.406: U1.4 J4.3
TO_TCH_LED_2
  Top 0.406: J4.2 U1.5
TO_TCH_LED_3
  Top 0.406: U1.6 J4.1
TO_TCH_LED_4
  Top 0.406: J5.5 U1.11
TO_TCH_LED_5
  Top 0.406: J5.4 U1.12
TO_TCH_LED_6
  Top 0.406: J5.3 U1.13
TO_TCH_LED_7
  Top 0.406: J5.2 U1.14
TO_TCH_LED_8  (via drill 0.35)
  Top 0.406: U1.15 96.52,16.19 97.16,15.56 v100.01,15.56
  Bottom 0.406: v100.01,15.56 100.01,9.53 J5.1
TO_TOUCH0  (1 unrouted)
  Bottom 0.406: 12.7,40.01 18.73,40.01 20.32,41.59 22.23,43.5 J2.1
TO_TOUCH1  (1 unrouted)
  Bottom 0.406: J2.2 33.66,41.59 32.07,40.01 25.4,40.01
TO_TOUCH2  (1 unrouted)
  Bottom 0.406: 38.1,40.01 J2.3
TO_TOUCH3  (1 unrouted)
  Bottom 0.406: 50.8,40.01 44.13,40.01 J2.4
TO_TOUCH4  (1 unrouted)
  Bottom 0.406: J2.5 45.4,41.27 55.56,41.27 56.2,41.27 57.47,40.01 63.5,40.01
TO_TOUCH5  (1 unrouted)
  Bottom 0.406: J2.6 46.99,42.23 47.31,41.91 64.45,41.91 65.09,41.91 66.99,40.01 76.2,40.01
TO_TOUCH6  (1 unrouted)
  Bottom 0.406: J2.7 51.44,46.67 57.47,46.67 81.92,46.67 88.9,39.69
TO_TOUCH7  (1 unrouted)
  Bottom 0.406: J2.8 53.02,45.72 65.09,45.72 69.53,41.27 83.5,41.27 84.77,41.27 87.63,38.42 91.44,38.42 100.33,38.42 101.6,39.69
TO_TOUCH8  (1 unrouted)
  Top 0.406: J2.9 51.44,45.4 45.72,45.4 23.81,45.4 23.5,45.4 22.23,46.67 21.91,46.99 21.91,52.39
TO_TOUCH9  (1 unrouted)
  Top 0.406: J2.10 57.78,45.4 68.26,45.4 85.09,45.4 86.04,45.4 102.23,45.4 106.68,49.85 106.68,52.39
TX
  Top 0.406: J6.3 U1.3

### Text on the board
_tsilk: V3 | GATE | DEGREE | OUT | V3